# Altium schematic sheet Sheet1.SchDoc: Main
size A4; SheetNumber: 1; SheetTotal: 1
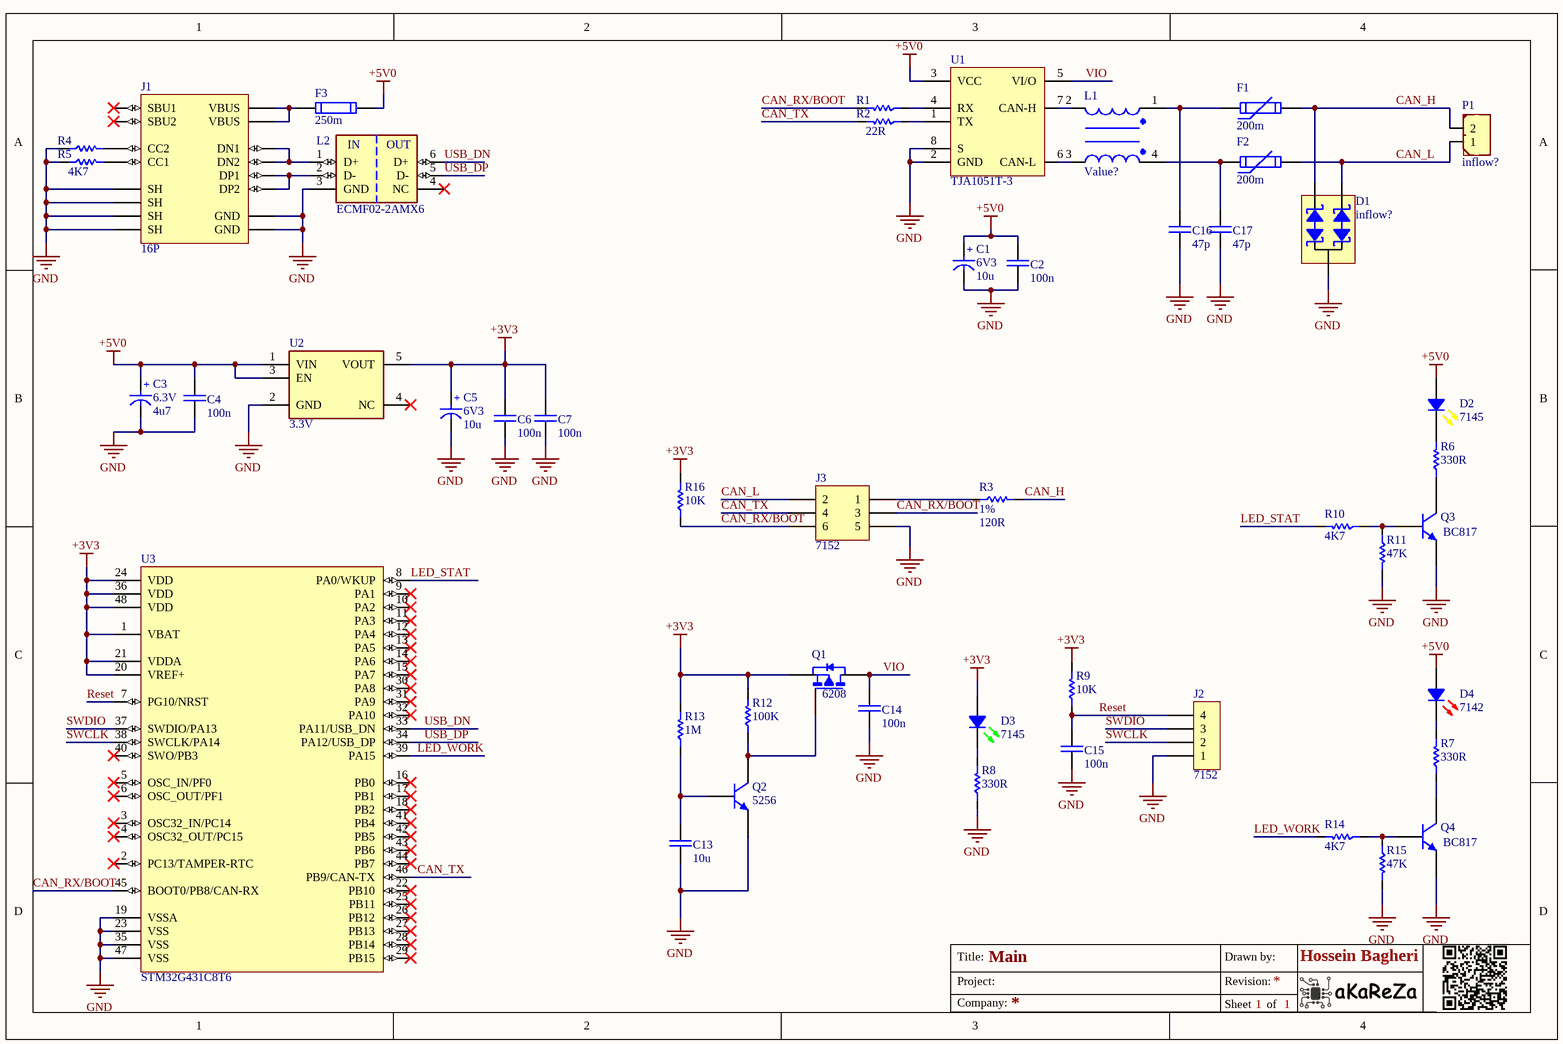
[diagram p0: Sheet1.SchDoc]

## Parts
C1  Rating: 6V3  [SMT_C_Tantalum_A]  (hidden comment: 10u)
C2  100n  [CAP 0805/2012]
C3  Rating: 6.3V  [SMT_C_Tantalum_A]  (hidden comment: 4u7)
C4  100n  [CAP 0805/2012]
C5  Rating: 6V3  [SMT_C_Tantalum_B]  (hidden comment: 10u)
C6  100n  [CAP 0805/2012]
C7  100n  [CAP 0805/2012]
C13  10u  [CAP 0805/2012]
C14  100n  [CAP 0805/2012]
C15  100n  [CAP 0805/2012]
C16  47p  [CAP 0805/2012]
C17  47p  [CAP 0805/2012]
D1  Inflow: inflow?  [SOT23_M]  (hidden comment: SM712)
D2  Inflow: 7145  [LED-3mm_Yellow]  (hidden comment: Yellow)
D3  Inflow: 7145  [led-3mm]  (hidden comment: Green, 3'mm)
D4  Inflow: 7142  [LED-3mm(RED)]  (hidden comment: Red, 3'mm)
F1  200m  [1206_F]
F2  200m  [1206_F]
F3  250m  [1206_F]
J1  16P  [USBC_SMD_16_USB4110 - Extended]
J2  Inflow: 7152  [HDR_THT_4M_2.54mm]  (hidden comment: 4b)
J3  Inflow: 7152  [HDR_THT_3x2M_2.54mm_RA]  (hidden comment: 3x2)
L1  Value?  [FIL_DLW31SN900SQ2L_Extended]
L2  ECMF02-2AMX6  [SON50P150X170X55-6N]
P1  Inflow: inflow?  [Phoenix_2PIN_RA_P5.08mm]  (hidden comment: 2'Pin)
Q1  Inflow: 6208  [SOT23_N]  (hidden comment: P-Channel)
Q2  Inflow: 5256  [SOT23_N]  (hidden comment: NPN)
Q3  BC817  [SOT23_N]
Q4  BC817  [SOT23_N]
R1  22R  [RES 0805 (2012X06L)]  (value not drawn)
R2  22R  [RES 0805 (2012X06L)]
R3  Type: 1%  [RES 0805 (2012X06L)]  (hidden comment: 120R)
R4  4K7  [RES 0805 (2012X06L)]
R5  4K7  [RES 0805 (2012X06L)]  (value not drawn)
R6  330R  [RES 0805 (2012X06L)]
R7  330R  [RES 0805 (2012X06L)]
R8  330R  [RES 0805 (2012X06L)]
R9  10K  [RES 0805 (2012X06L)]
R10  4K7  [RES 0805 (2012X06L)]
R11  47K  [RES 0805 (2012X06L)]
R12  100K  [RES 0805 (2012X06L)]
R13  1M  [RES 0805 (2012X06L)]
R14  4K7  [RES 0805 (2012X06L)]
R15  47K  [RES 0805 (2012X06L)]
R16  10K  [RES 0805 (2012X06L)]
U1  TJA1051T-3  [SO8_narrow_M]
U2  3.3V  [SOT95P280X130-5N]
U3  STM32G431C8T6  [LQFP48_N]

## Nets
+3V3: C5.1(+) C6.1 C7.1 D3.1 Q1.2(S) R9.2 R12.2 R13.2 R16.2 U2.5(VOUT) U3.1(VBAT) U3.20(VREF+) U3.21(VDDA) U3.24(VDD) U3.36(VDD) U3.48(VDD)
+5V0: C1.1(+) C2.1 C3.1(+) C4.1 D2.1 D4.1 F3.2 U1.3(VCC) U2.1(VIN) U2.3(EN)
GND: C1.2(-) C2.2 C3.2(-) C4.2 C5.2(-) C6.2 C7.2 C13.2 C14.2 C15.2 C16.2 C17.2 D1.3 J1.A1B12(GND) J1.B1A12(GND) J1.S1(SH) J1.S2(SH) J1.S3(SH) J1.S4(SH) J2.1 J3.5 L2.3(GND) Q2.2(E) Q3.2(E) Q4.2(E) R4.1 R5.1 R8.1 R11.2 R15.2 U1.2(GND) U1.8(S) U2.2(GND) U3.19(VSSA) U3.23(VSS) U3.35(VSS) U3.47(VSS)
CAN_H: D1.1 F1.2 P1.2 R3.2
CAN_L: D1.2 F2.2 J3.2 P1.1
CAN_RX/BOOT: J3.3 J3.6 R1.2 R16.1 U3.45(BOOT0/PB8/CAN-RX)
CAN_TX: J3.4 R2.2 U3.46(PB9/CAN-TX)
LED_STAT: R10.2 U3.8(PA0/WKUP)
LED_WORK: R14.2 U3.39(PA15)
Reset: C15.1 J2.4 R9.1 U3.7(PG10/NRST)
SWCLK: J2.2 U3.38(SWCLK/PA14)
SWDIO: J2.3 U3.37(SWDIO/PA13)
USB_DN: L2.6(D+) U3.33(PA11/USB_DN)
USB_DP: L2.5(D-) U3.34(PA12/USB_DP)
VIO: C14.1 Q1.3(D) U1.5(VI/O)
NetC13_1: C13.1 Q2.1(B) R13.1
NetC16_1: C16.1 F1.1 L1.1
NetC17_1: C17.1 F2.1 L1.4
NetD2_2: D2.2 R6.2
NetD3_2: D3.2 R8.2
NetD4_2: D4.2 R7.2
NetF3_1: F3.1 J1.A4B9(VBUS) J1.B4A9(VBUS)
NetJ1_A5: J1.A5(CC1) R4.2
NetJ1_A6: J1.A6(DP1) J1.B6(DP2) L2.2(D-)
NetJ1_A7: J1.A7(DN1) J1.B7(DN2) L2.1(D+)
NetJ1_B5: J1.B5(CC2) R5.2
NetJ3_1: J3.1 R3.1
NetL1_2: L1.2 U1.7(CAN-H)
NetL1_3: L1.3 U1.6(CAN-L)
NetQ1_1: Q1.1(G) Q2.3(C) R12.1
NetQ3_1: Q3.1(B) R10.1 R11.1
NetQ3_3: Q3.3(C) R6.1
NetQ4_1: Q4.1(B) R14.1 R15.1
NetQ4_3: Q4.3(C) R7.1
NetR1_1: R1.1 U1.4(RX)
NetR2_1: R2.1 U1.1(TX)

Not connected (* = marked no-connect by the designer): J1 A8(SBU1)* B8(SBU2)*; L2 4(NC)*; U2 4(NC)*; U3 2(PC13/TAMPER-RTC)* 3(OSC32_IN/PC14)* 4(OSC32_OUT/PC15)* 5(OSC_IN/PF0)* 6(OSC_OUT/PF1)* 9(PA1)* 10(PA2)* 11(PA3)* 12(PA4)* 13(PA5)* 14(PA6)* 15(PA7)* 16(PB0)* 17(PB1)* 18(PB2)* 22(PB10)* 25(PB11)* 26(PB12)* 27(PB13)* 28(PB14)* 29(PB15)* 30(PA8)* 31(PA9)* 32(PA10)* 40(SWO/PB3)* 41(PB4)* 42(PB5)* 43(PB6)* 44(PB7)*

## Notes on the sheet
- Title:
- Project:
- Drawn by:
- Revision:
- Hossein Bagheri
- Company:
- Sheet
- of
- (in symbol Ind_EMI_ECMF02-2AMX6) IN; OUT

## Library data of the parts
C1 C5 = Cap_Tantalum: Tantalum Capacitor,TAJ Series-SMD; Inflow: inflow?; Validation: Valid; Package: Package?; Type: Tantalum; Value: 10u
C2 C6 C7 C14 C15 = Cap_Multi_SMD_100nF_0805: Bipolar ceramic capacitor SMD; Inflow: inflow?; Type: MultiLayer; Rating: 50V; Validation: Valid; Package: 0805; Value: 100n
C3 = Cap_Tantalum: Tantalum Capacitor,TAJ Series-SMD; Inflow: inflow?; Package: SMD-A; Type: Tantalum; Value: 4u7
C4 = Cap_Multi_SMD_100nF_0805: Bipolar ceramic capacitor SMD; Inflow: inflow?; Type: MultiLayer; Rating: 50V; Package: 0805; Value: 100n
C13 C16 C17 = Cap_Multi_SMD_0805: Bipolar ceramic capacitor SMD; Inflow: inflow?; Type: MultiLayer; Rating: Rating?; Validation: Valid; Package: 0805
  C13: Value: 10u
  C16 C17: Value: 47p
D1 = Semi_Diod_TVS_SM712: TVS, ESD PROTECT, 2CH, 400W/17A PP, 7.5VBR, ±8KV ESDmin; Rating: Rating?; Type: Type?; Validation: Valid; Value: SM712; Package: Package?
D2 = Semi_LED_Yellow_3: LED; Rating: Rating?; Validation: Valid; Value: Yellow; Package: 3mm; Type: LED
D3 = Semi_LED_Green_3: LED; Rating: Rating?; Type: Type?; Validation: Valid; Value: Green, 3'mm; Package: Package?
D4 = Semi_LED_Red_3: LED; Rating: Rating?; Type: Type?; Validation: Valid; Value: Red, 3'mm; Package: Package?
F1 F2 = Other_Elec_PFUSE_SMD: SMD Resettable Fuses; Inflow: inflow?; Rating: 24V; Validation: Valid; Package: 1206; Type: Resettable; Value: 200m
F3 = Other_Elec_Fuse_SMD: Short circiut  protection; Inflow: 0.5A; Type: Fast; Rating: Rating?; Package: 1206; Value: 250m
J1 = Con_USB_C_16P: USB C Female Connector; Rating: Rating?; Validation: NT; Inflow: inflow?; Value: 16P; Package: SMD; Type: C
J2 = Con_MPH_4x1_V_THT_2.54: Header, single row, 4 pin; Rating: 4x1; Validation: NT; Type: Vertical; Package: Dip; Value: 4b
J3 = Con_MPH_3x2_V_THT_2.54: Header, dual row, 6 pin; Rating: Rating?; Validation: NT; Value: 3x2; Package: Package?; Type: Type?
L1 = Ind_EMI_DLW31SN900SQ2L: 2 Line Common Mode Choke Surface Mount 90 Ohms @ 100 MHz 370mA DCR 300mOhm; Rating: Rating?; Type: Type?; Validation: Valid; Inflow: inflow?; Value: Value?; Package: Package?
L2 = Ind_EMI_ECMF02-2AMX6: Common Mode Filter with ESD Protection for USB 2.0 and MIPI D-PHY/MDDI Interface; Rating: 2.5R; Type: EMI Filters; Validation: NT; Package: QFN-6; Value: ECMF02-2AMX6
P1 = Con_Power_2: Power Connector 2'Pin; Rating: Rating?; Validation: NT; Value: 2'Pin; Package: Package?; Type: Type?
Q1 = Semi_MOSFET_Si2301DS: P-Channel MOSFET; Rating: Rating?; Type: Type?; Validation: NT; Value: P-Channel; Package: Package?
Q2 = Semi_BJT_SS8050: NPN General purpose Transistor; Rating: Rating?; Type: Type?; Validation: Valid; Value: NPN; Package: Package?
Q3 Q4 = Semi_BJT_BC817: NPN General purpose Transistor; Rating: Rating?; Validation: Valid; Inflow: inflow?; Value: BC817; Package: Package?; Type: NPN
R1-R3 R6-R16 = Res_SMD_0805: Resistor; Inflow: inflow?; Rating: 0.125W; Validation: Valid; Package: 0805
  R1 R2: Type: 10%; Value: 22R
  R3: Value: 120R
  R6-R8: Type: 10%; Value: 330R
  R9 R16: Type: 10%; Value: 10K
  R10 R14: Type: 10%; Value: 4K7
  R11 R15: Type: 10%; Value: 47K
  R12: Type: 10%; Value: 100K
  R13: Type: 10%; Value: 1M
R4 R5 = Res_SMD_0805: Resistor; Inflow: inflow?; Rating: 0.125W; Package: 0805; Type: 10%; Value: 4K7
U1 = IC_Converter_TJA1051T-3: High-Speed CAN Transceiver That Provides an Interface Between a CAN Protocol Controller and The Physical Two-Wire CAN Bus.; Rating: 5Mbits/s; Validation: NT; Inflow: inflow?; Value: TJA1051T-3; Package: SOIC-8; Type: CAN-FD
U2 = IC_Reg_TLV74333PDBVR: Fixed LDO Voltage Regulator 3.3V 300mA SOT-23-5; Rating: 300m; Validation: Valid; Inflow: inflow?; Type: LDO; Package: SOT-23-5; Value: 3.3V
U3 = IC_MCU_STM32G431C8T6: 32-Bit mircrocontroller; Validation: NT; Rating: CORTEX-M4; Inflow: inflow?; Type: Microcontroller; Package: LQFP48; Value: STM32G431C8T6